# Altium schematic sheet ESP32.SchDoc
size A
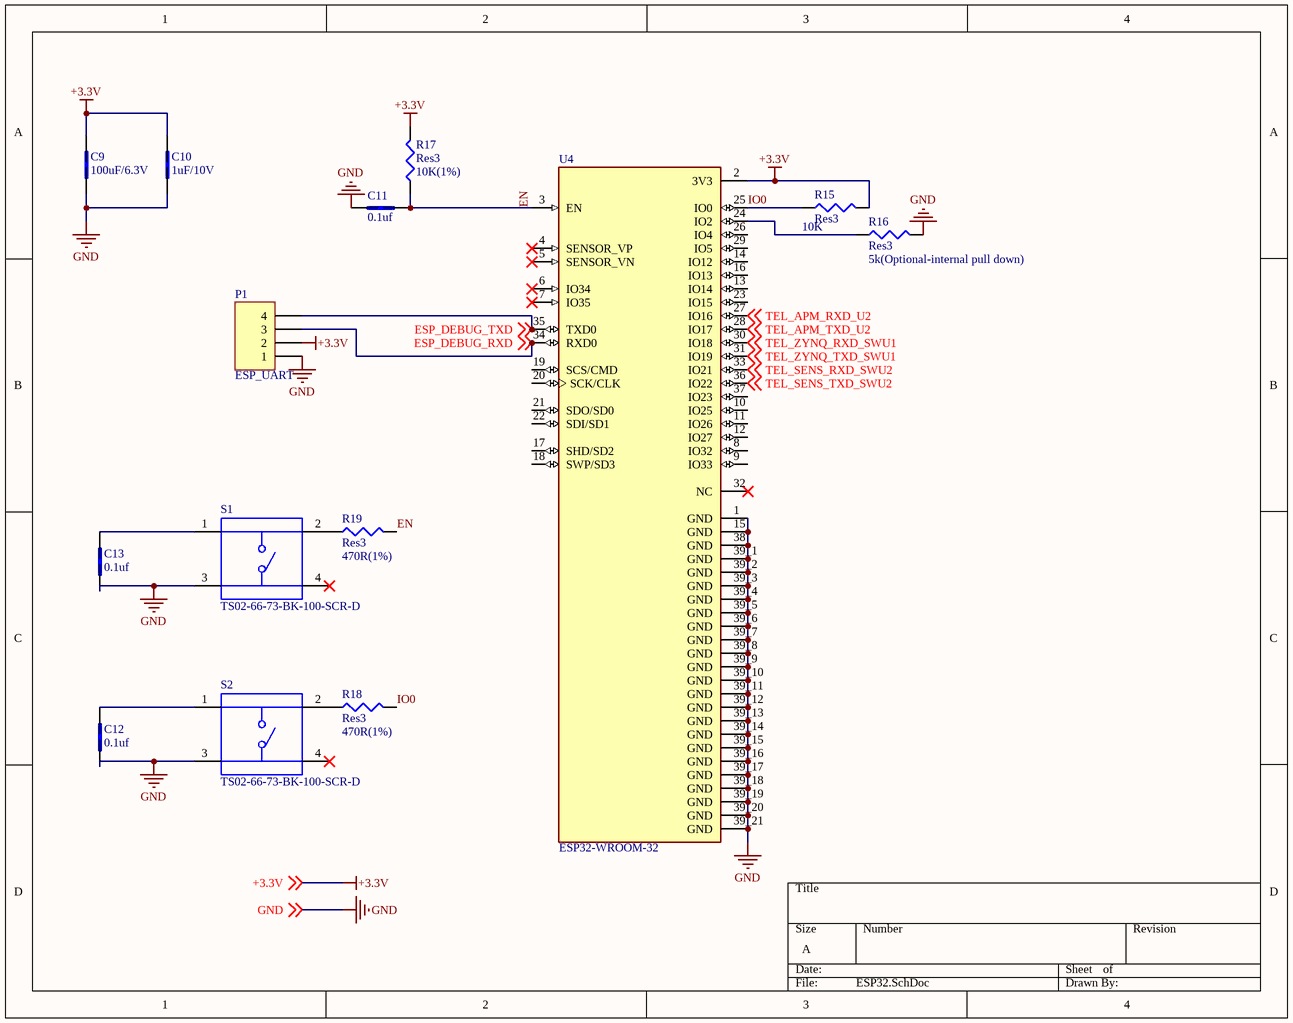
[diagram p0: ESP32.SchDoc]

## Parts
C9  100uF/6.3V  [CAPC1608X90]
C10  1uF/10V  [CAPC1608X90]
C11  0.1uf  [CAPC1608X90]
C12  0.1uf  [CAPC1608X90]
C13  0.1uf  [CAPC1608X90]
P1  ESP_UART  [HDR1X4]
R15  Res3  value 10K  [J1-0603]
R16  Res3  value 5k(Optional-internal pull down)  [J1-0603]
R17  Res3  value 10K(1%)  [J1-0603]
R18  Res3  value 470R(1%)  [J1-0603]
R19  Res3  value 470R(1%)  [J1-0603]
S1  TS02-66-73-BK-100-SCR-D  [SW_TS02-66-73-BK-100-SCR-D]
S2  TS02-66-73-BK-100-SCR-D  [SW_TS02-66-73-BK-100-SCR-D]
U4  ESP32-WROOM-32  [MODULE_ESP32-WROOM-32]

## Nets
+3.3V: C9.2 C10.2 P1.2 R15.2 R17.2 U4.2(3V3) ; off-sheet +3.3V
GND: C9.1 C10.1 C11.2 C12.2 C13.2 P1.1 R16.2 S1.3 S2.3 U4.1(GND) U4.15(GND) U4.38(GND) U4.39_1(GND) U4.39_2(GND) U4.39_3(GND) U4.39_4(GND) U4.39_5(GND) U4.39_6(GND) U4.39_7(GND) U4.39_8(GND) U4.39_9(GND) U4.39_10(GND) U4.39_11(GND) U4.39_12(GND) U4.39_13(GND) U4.39_14(GND) U4.39_15(GND) U4.39_16(GND) U4.39_17(GND) U4.39_18(GND) U4.39_19(GND) U4.39_20(GND) U4.39_21(GND) ; off-sheet GND
EN: C11.1 R17.1 R19.2 U4.3(EN)
ESP_DEBUG_RXD: P1.3 U4.34(RXD0) ; off-sheet ESP_DEBUG_RXD
ESP_DEBUG_TXD: P1.4 U4.35(TXD0) ; off-sheet ESP_DEBUG_TXD
IO0: R15.1 R18.2 U4.25(IO0)
TEL_APM_RXD_U2: U4.27(IO16) ; off-sheet TEL_APM_RXD_U2
TEL_APM_TXD_U2: U4.28(IO17) ; off-sheet TEL_APM_TXD_U2
TEL_SENS_RXD_SWU2: U4.33(IO21) ; off-sheet TEL_SENS_RXD_SWU2
TEL_SENS_TXD_SWU2: U4.36(IO22) ; off-sheet TEL_SENS_TXD_SWU2
TEL_ZYNQ_RXD_SWU1: U4.30(IO18) ; off-sheet TEL_ZYNQ_RXD_SWU1
TEL_ZYNQ_TXD_SWU1: U4.31(IO19) ; off-sheet TEL_ZYNQ_TXD_SWU1
NetC12_1: C12.1 S2.1
NetC13_1: C13.1 S1.1
NetR16_1: R16.1 U4.24(IO2)
NetR18_1: R18.1 S2.2
NetR19_1: R19.1 S1.2

Not connected (* = marked no-connect by the designer): S1 4*; S2 4*; U4 4(SENSOR_VP)* 5(SENSOR_VN)* 6(IO34)* 7(IO35)* 8(IO32) 9(IO33) 10(IO25) 11(IO26) 12(IO27) 13(IO14) 14(IO12) 16(IO13) 17(SHD/SD2) 18(SWP/SD3) 19(SCS/CMD) 20(SCK/CLK) 21(SDO/SD0) 22(SDI/SD1) 23(IO15) 26(IO4) 29(IO5) 32(NC)* 37(IO23)

## Library data of the parts
C9-C13 = C0603C104K5RACTU: 0.1ÂµF Â±10% 50V Ceramic Capacitor X7R 0603 (1608 Metric); MF: KEMET; SnapEDA_Link: https://www.snapeda.com/parts/C0603C104K5RACTU/KEMET/view-part/52584/?ref=snap; MP: C0603C104K5RACTU; Check_prices: https://www.snapeda.com/parts/C0603C104K5RACTU/KEMET/view-part/52584/?ref=eda; Digi-Key_Part_Number: 399-5089-1-ND; Value: *; Package: 0603 Kemet; Purchase-URL: https://pricing.snapeda.com/search/part/C0603C104K5RACTU/?ref=eda
P1 = Header 4: Header, 4-Pin; LatestRevisionDate: 17-Jul-2002; LatestRevisionNote: Re-released for DXP Platform.; Publisher: Altium Limited
R15-R19 = Res3: Resistor; Published: 8-Jun-2000; LatestRevisionDate: 29-May-2009; LatestRevisionNote: IPC-7351 Footprint Added.; PackageReference: J1-0603; Publisher: Altium Limited; PackageDescription: Chip Resistor
S1 S2 = TS02-66-73-BK-100-SCR-D: MF: {'manufacturer': u'CUI'}; Value: *; Package: None; Availability: Unavailable; MP: TS02-66-73-BK-100-SCR-D; Price: None
U4 = ESP32-WROOM-32: Package: None; MP: ESP32-WROOM-32; Value: *; Price: None; Availability: Unavailable